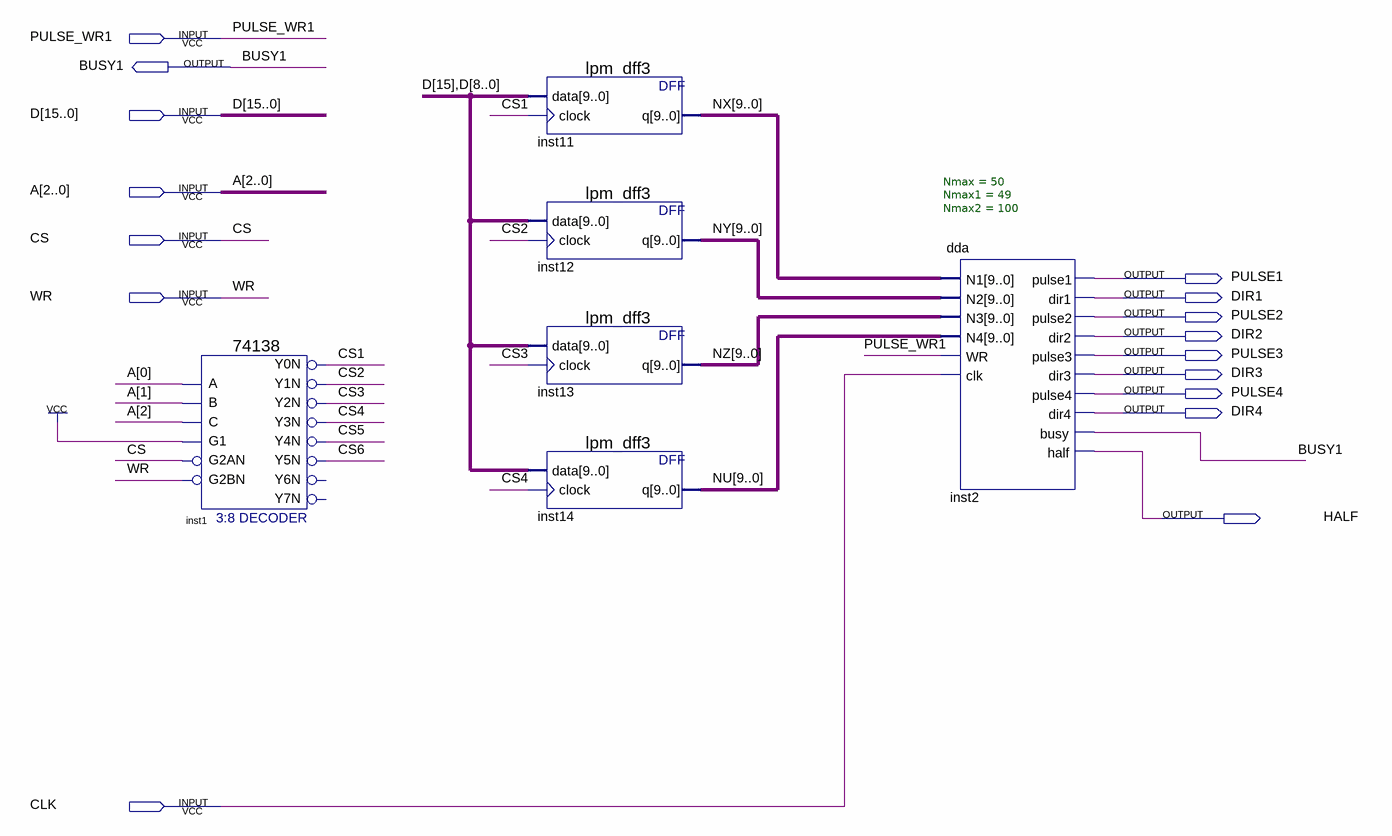
[diagram p0: schematic sheet]
// Quartus schematic dda_module.bdf as structural Verilog: 6 symbols, 16 pins
module dda_module (
  input  PULSE_WR1,
  input  [15:0] D,
  input  [2:0] A,
  input  CS,
  input  WR,
  input  CLK,
  output BUSY1,
  output PULSE1,
  output DIR1,
  output PULSE2,
  output DIR2,
  output PULSE3,
  output DIR3,
  output PULSE4,
  output DIR4,
  output HALF
);

  wire CS1, CS2, CS3, CS4, CS5, CS6;
  wire [9:0] NU, NX, NY, NZ;

  \74138  inst1 (
    .A(A[0]), .B(A[1]), .G1(1'b1), .C(A[2]), .G2AN(CS), .G2BN(WR), .Y0N(CS1), .Y1N(CS2), .Y2N(CS3),
    .Y3N(CS4), .Y4N(CS5), .Y5N(CS6));  // open: Y6N, Y7N
  lpm_dff3 inst11 (.data({D[15], D[8:0]}), .clock(CS1), .q(NX));
  lpm_dff3 inst12 (.data({D[15], D[8:0]}), .clock(CS2), .q(NY));
  lpm_dff3 inst13 (.data({D[15], D[8:0]}), .clock(CS3), .q(NZ));
  lpm_dff3 inst14 (.data({D[15], D[8:0]}), .clock(CS4), .q(NU));
  dda #(.Nmax(50), .Nmax1(49), .Nmax2(100)) inst2 (
    .N1(NX), .N2(NY), .N3(NZ), .N4(NU), .WR(PULSE_WR1), .clk(CLK), .pulse1(PULSE1), .dir1(DIR1),
    .pulse2(PULSE2), .dir2(DIR2), .pulse3(PULSE3), .dir3(DIR3), .pulse4(PULSE4), .dir4(DIR4), .busy(BUSY1),
    .half(HALF));
endmodule
